# EAGLE design capsenbrd (EAGLE 7.6.0)

## Sheet 1 of 3
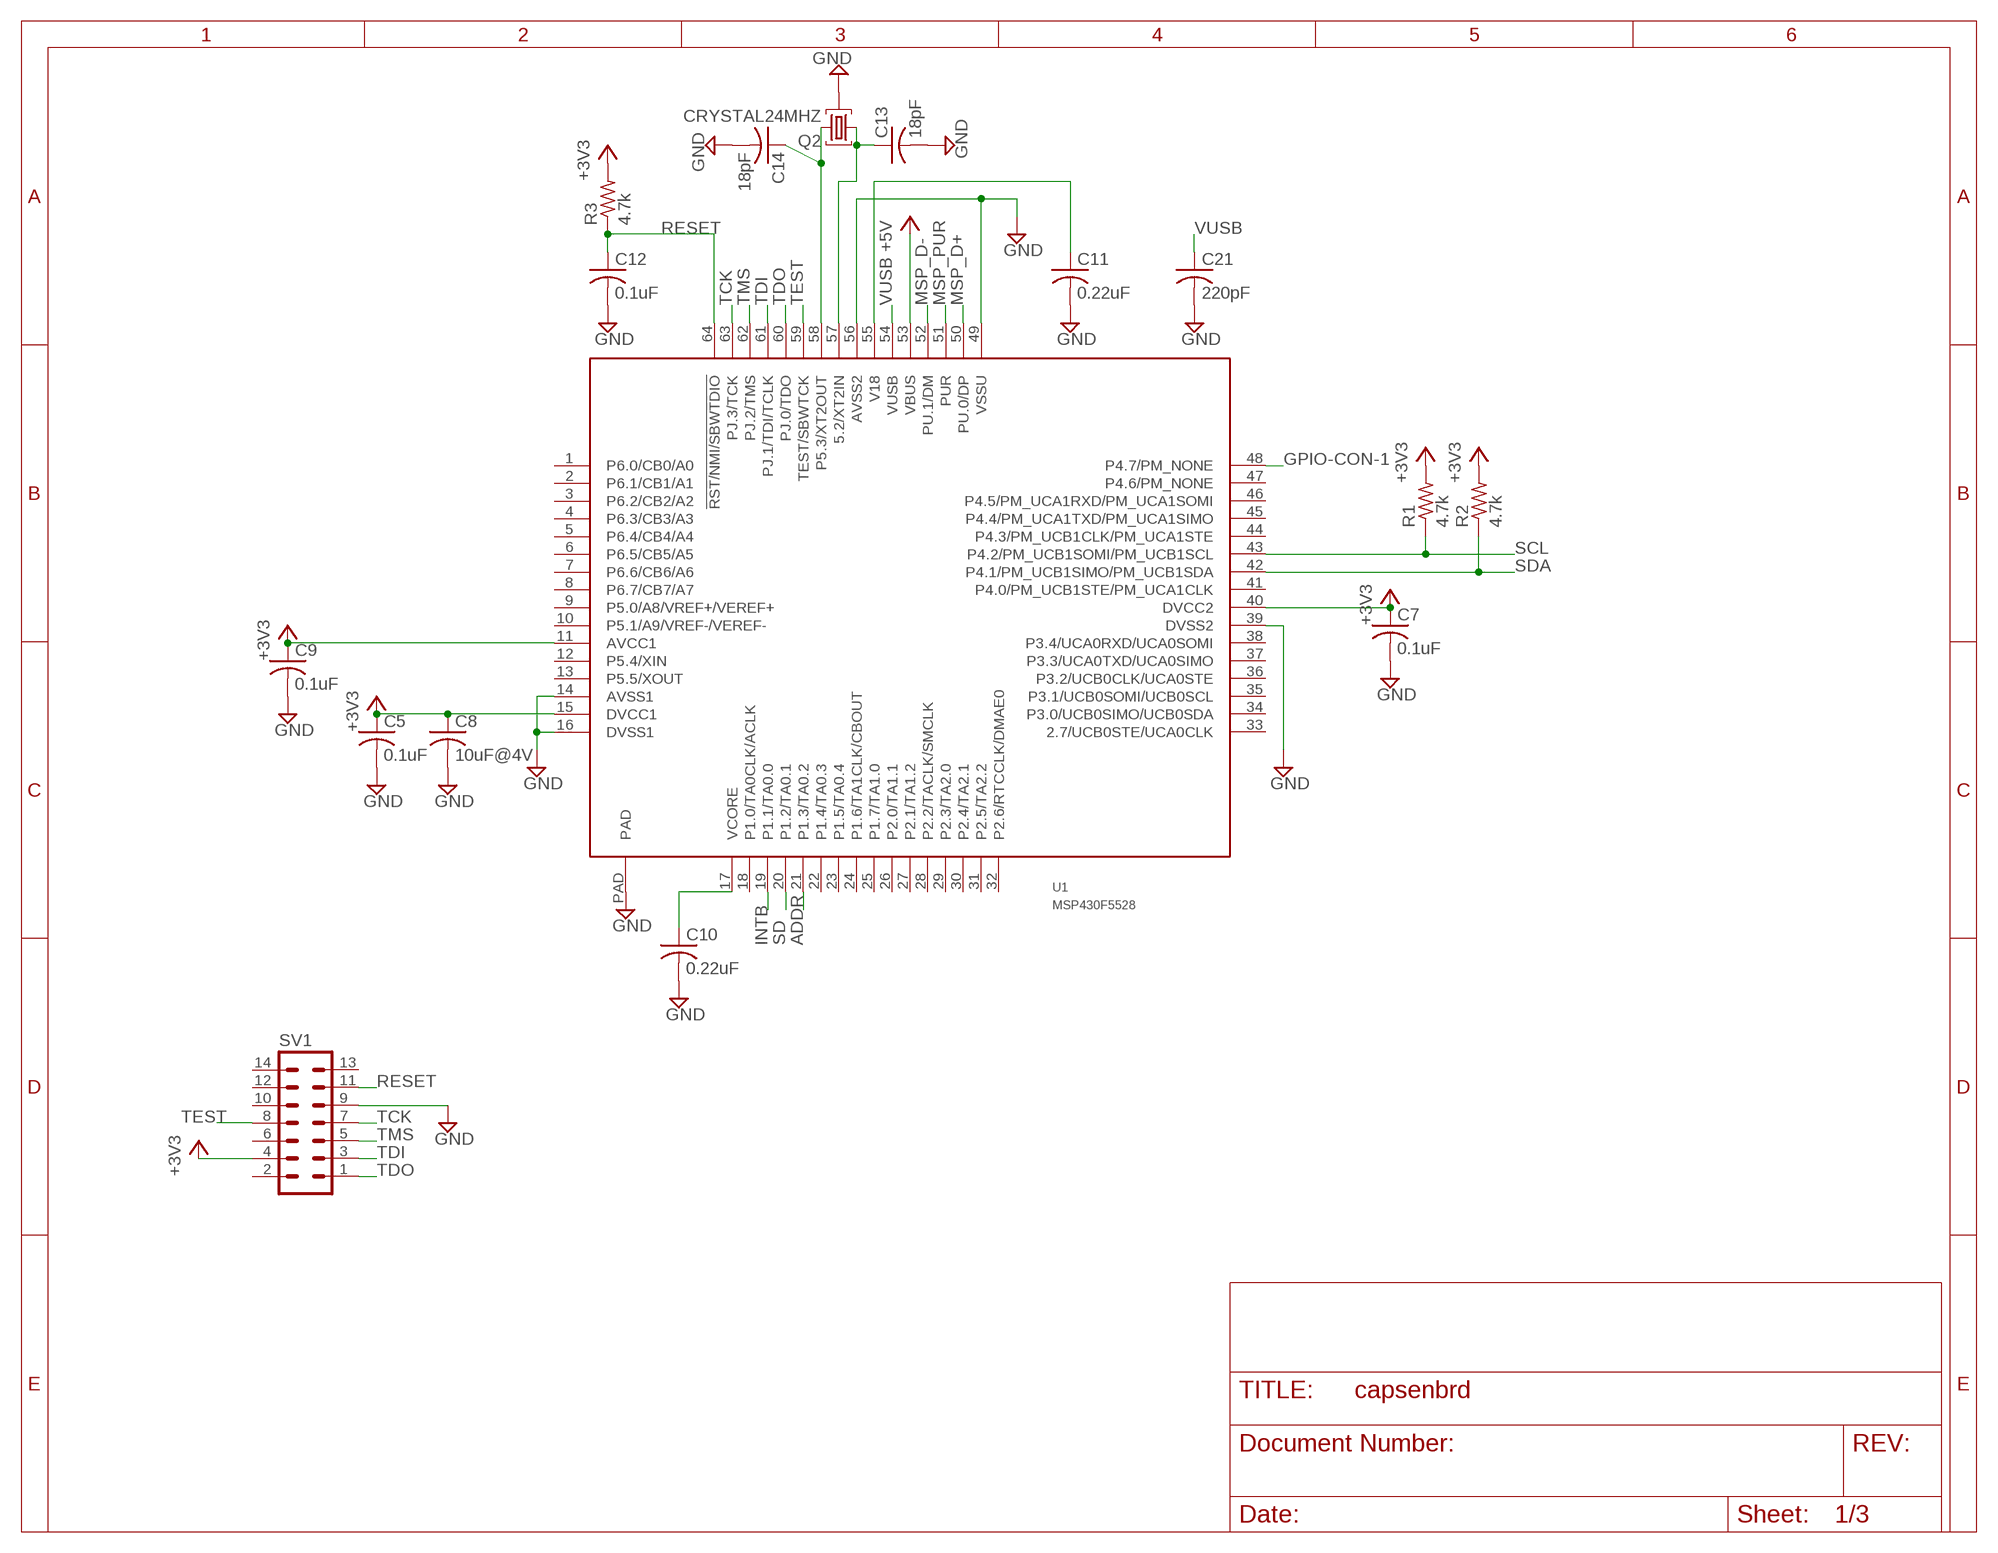
[diagram p0: schematic, sheet 1]

### Parts
C5  0.1uF  C-US0.1UFC0603  [C0603]
C7  0.1uF  C-US0.1UFC0603  [C0603]
C8  10uF@4V  C-US10UFC0603  [C0603]
C9  0.1uF  C-US0.1UFC0603  [C0603]
C10  0.22uF  C-US0.22UFC0603  [C0603]
C11  0.22uF  C-US0.22UFC0603  [C0603]
C12  0.1uF  C-US0.1UFC0603  [C0603]
C13  18pF  C-US18PFC0603  [C0603]
C14  18pF  C-US18PFC0603  [C0603]
C21  220pF  C-US-220PF-C0603  [C0603]
Q2  CRYSTAL24MHZ  [ABM8]
R1  4.7k  R-US_4.7KR0603  [R0603]
R2  4.7k  R-US_4.7KR0603  [R0603]
R3  4.7k  R-US_4.7KR0603  [R0603]
SV1  MA07-2SMT  [MA07-2-SMT]
U1  MSP430F5528  [-RGC-N64]

### Nets
+3V3: C5.1 C7.1 C8.1 C9.1 R1.2 R2.2 R3.2 SV1.4 U1.11(AVCC1) U1.15(DVCC1) U1.40(DVCC2) ; also sheet 2,3
+5V: U1.53(VBUS) ; also sheet 2,3
ADDR: U1.21(P1.3/TA0.2) ; also sheet 2
GND: C5.2 C7.2 C8.2 C9.2 C10.2 C11.2 C12.2 C13.2 C14.2 C21.2 Q2.2 Q2.4 SV1.9 U1.14(AVSS1) U1.16(DVSS1) U1.39(DVSS2) U1.49(VSSU) U1.56(AVSS2) U1.PAD ; also sheet 2,3
GPIO-CON-1: U1.48(P4.7/PM_NONE) ; also sheet 2
INTB: U1.19(P1.1/TA0.0) ; also sheet 2
MSP_D+: U1.50(PU.0/DP) ; also sheet 3
MSP_D-: U1.52(PU.1/DM) ; also sheet 3
MSP_PUR: U1.51(PUR) ; also sheet 3
N$2: C11.1 U1.55(V18)
N$3: C10.1 U1.17(VCORE)
N$5: C13.1 Q2.1 U1.57(5.2/XT2IN)
N$6: C14.1 Q2.3 U1.58(P5.3/XT2OUT)
RESET: C12.1 R3.1 SV1.11 U1.64(!RST/NMI/SBWTDIO)
SCL: R1.1 U1.43(P4.2/PM_UCB1SOMI/PM_UCB1SCL) ; also sheet 2
SD: U1.20(P1.2/TA0.1) ; also sheet 2
SDA: R2.1 U1.42(P4.1/PM_UCB1SIMO/PM_UCB1SDA) ; also sheet 2
TCK: SV1.7 U1.63(PJ.3/TCK)
TDI: SV1.3 U1.61(PJ.1/TDI/TCLK)
TDO: SV1.1 U1.60(PJ.0/TDO)
TEST: SV1.8 U1.59(TEST/SBWTCK)
TMS: SV1.5 U1.62(PJ.2/TMS)
VUSB: C21.1 U1.54(VUSB)
Unconnected: SV1.2 SV1.6 SV1.10 SV1.12 SV1.13 SV1.14 U1.1(P6.0/CB0/A0) U1.2(P6.1/CB1/A1) U1.3(P6.2/CB2/A2) U1.4(P6.3/CB3/A3) U1.5(P6.4/CB4/A4) U1.6(P6.5/CB5/A5) U1.7(P6.6/CB6/A6) U1.8(P6.7/CB7/A7) U1.9(P5.0/A8/VREF+/VEREF+) U1.10(P5.1/A9/VREF-/VEREF-) U1.12(P5.4/XIN) U1.13(P5.5/XOUT) U1.18(P1.0/TA0CLK/ACLK) U1.22(P1.4/TA0.3) U1.23(P1.5/TA0.4) U1.24(P1.6/TA1CLK/CBOUT) U1.25(P1.7/TA1.0) U1.26(P2.0/TA1.1) U1.27(P2.1/TA1.2) U1.28(P2.2/TACLK/SMCLK) U1.29(P2.3/TA2.0) U1.30(P2.4/TA2.1) U1.31(P2.5/TA2.2) U1.32(P2.6/RTCCLK/DMAE0) U1.33(2.7/UCB0STE/UCA0CLK) U1.34(P3.0/UCB0SIMO/UCB0SDA) U1.35(P3.1/UCB0SOMI/UCB0SCL) U1.36(P3.2/UCB0CLK/UCA0STE) U1.37(P3.3/UCA0TXD/UCA0SIMO) U1.38(P3.4/UCA0RXD/UCA0SOMI) U1.41(P4.0/PM_UCB1STE/PM_UCA1CLK) U1.44(P4.3/PM_UCB1CLK/PM_UCA1STE) U1.45(P4.4/PM_UCA1TXD/PM_UCA1SIMO) U1.46(P4.5/PM_UCA1RXD/PM_UCA1SOMI) U1.47(P4.6/PM_NONE)

## Sheet 2 of 3
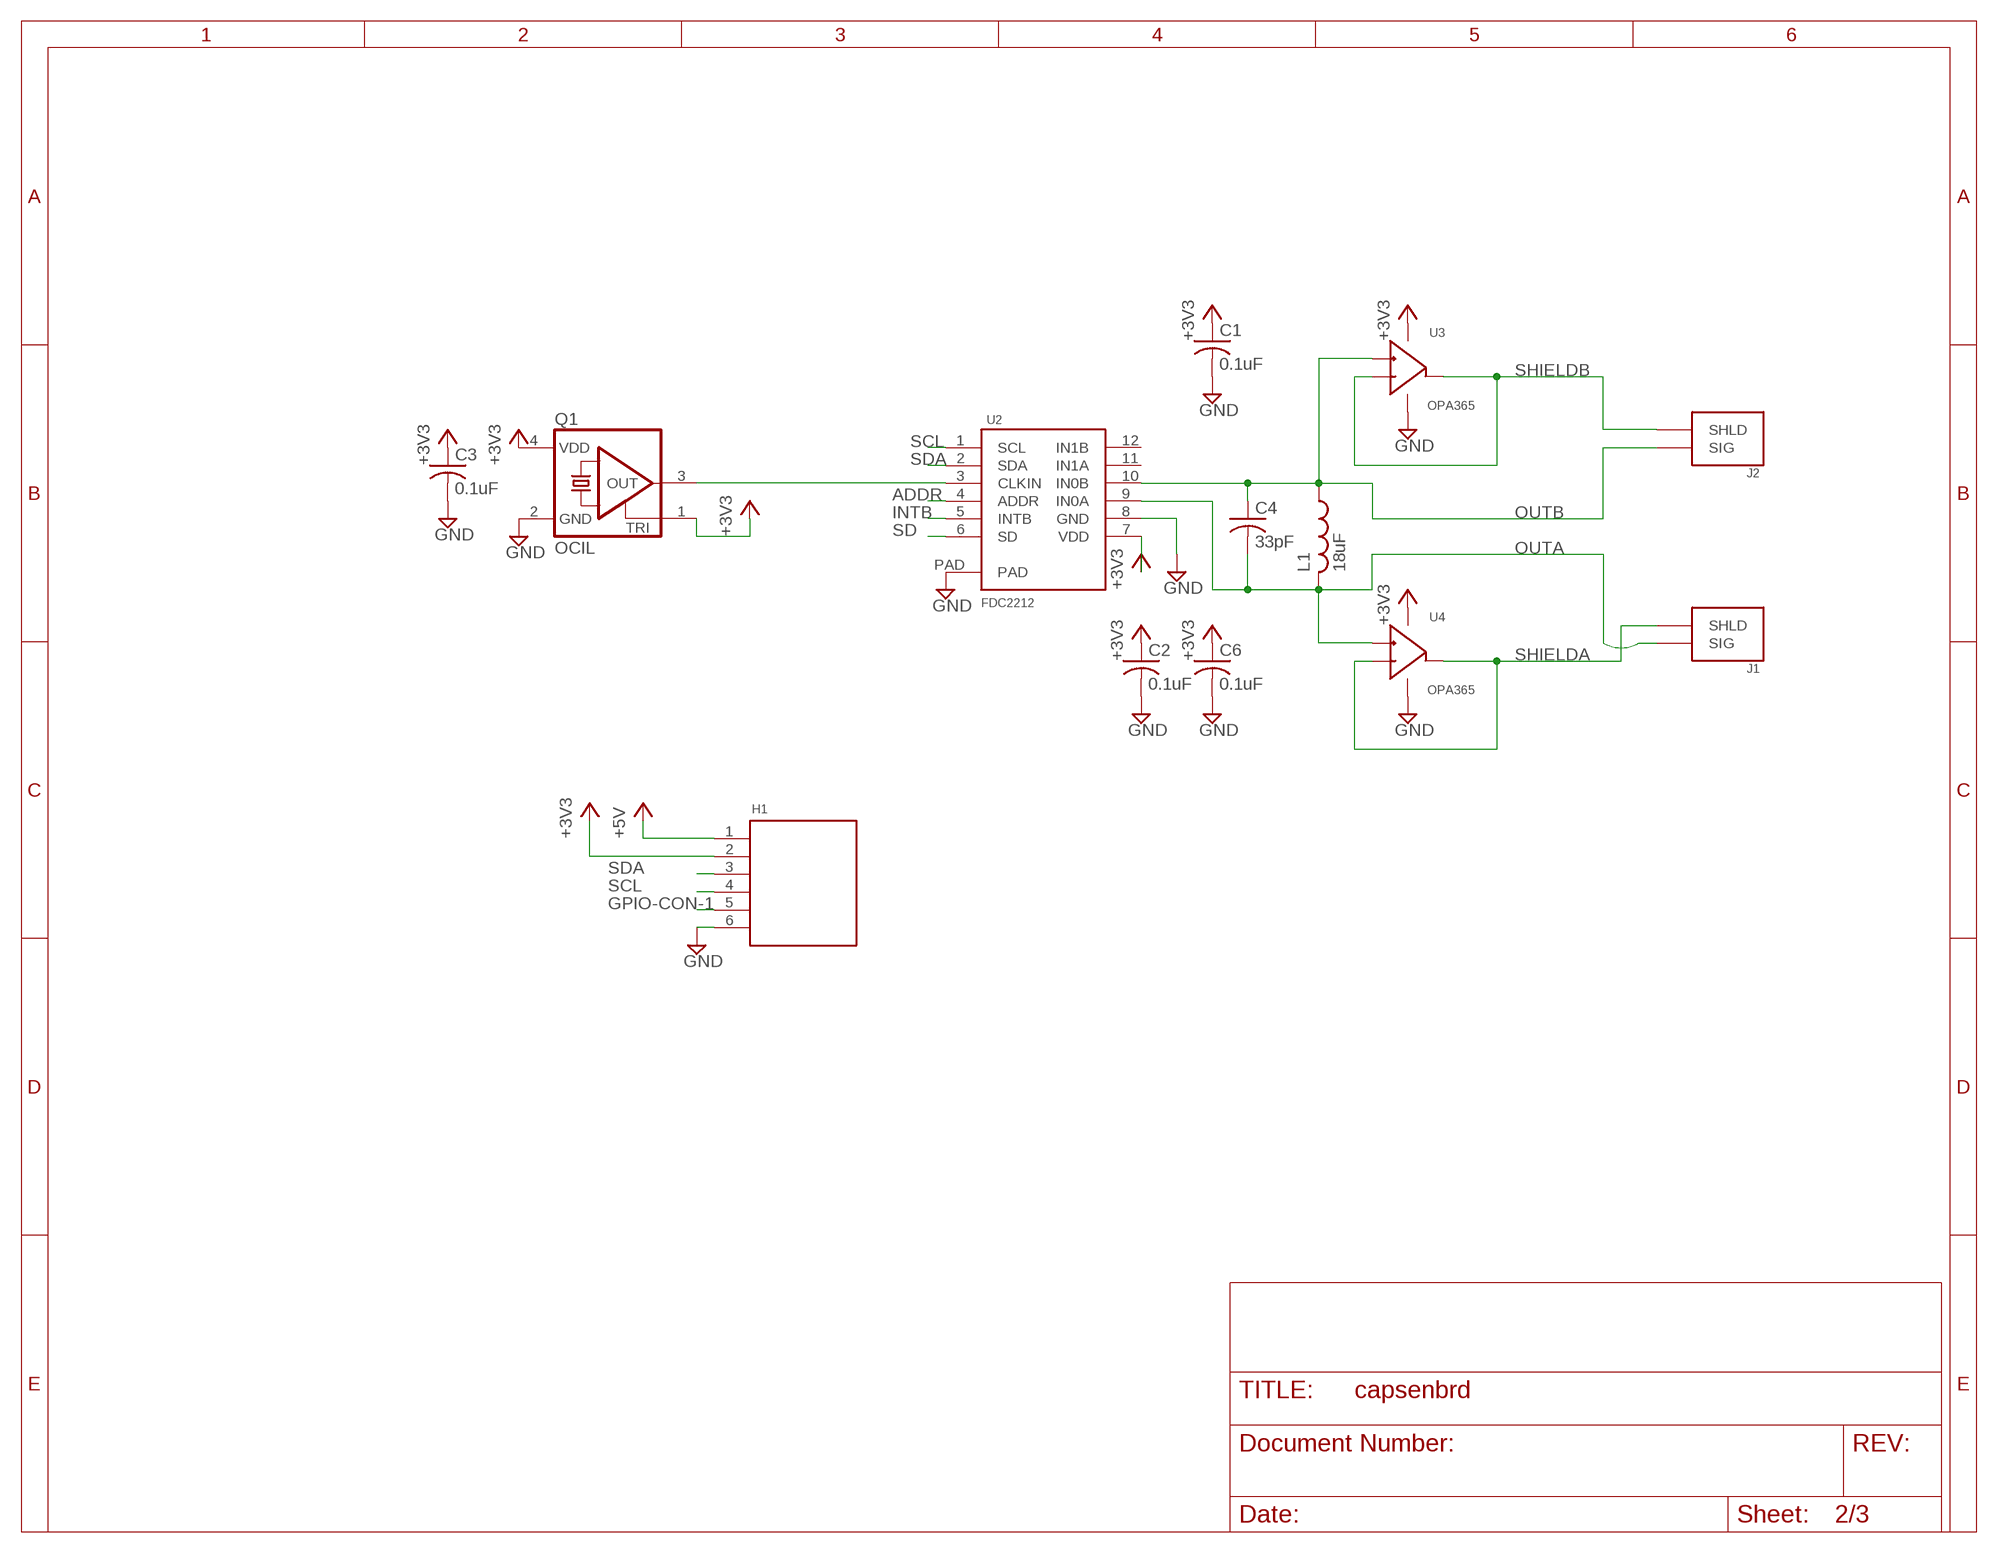
[diagram p1: schematic, sheet 2]

### Parts
C1  0.1uF  C-US0.1UFC0603  [C0603]
C2  0.1uF  C-US0.1UFC0603  [C0603]
C3  0.1uF  C-US0.1UFC0603  [C0603]
C4  33pF  C-US-33PF-C0603  [C0603]
C6  0.1uF  C-US0.1UFC0603  [C0603]
H1  CON-6-1  [10114828-10106LF]
J1  SMA-SMT-  [0732511352]
J2  SMA-SMT-  [0732511352]
L1  18uF  L-US-18UF-L1210  [L1210]
Q1  OCIL  [625L3C040M00000]
U2  FDC2212  [-WSON]
U3  OPA365  [-DBV]
U4  OPA365  [-DBV]

### Nets
+3V3: C1.1 C2.1 C3.1 C6.1 H1.2 Q1.1(TRI) Q1.4(VDD) U2.7(VDD) U3.5(V+) U4.5(V+) ; also sheet 1,3
+5V: H1.1 ; also sheet 1,3
ADDR: U2.4(ADDR) ; also sheet 1
GND: C1.2 C2.2 C3.2 C6.2 H1.6 Q1.2(GND) U2.8(GND) U2.PAD U3.2(V-) U4.2(V-) ; also sheet 1,3
GPIO-CON-1: H1.5 ; also sheet 1
INTB: U2.5(INTB) ; also sheet 1
N$1: Q1.3(OUT) U2.3(CLKIN)
OUTA: C4.2 J1.SIG L1.P$2 U2.9(IN0A) U4.3(IN+)
OUTB: C4.1 J2.SIG L1.P$1 U2.10(IN0B) U3.3(IN+)
SCL: H1.4 U2.1(SCL) ; also sheet 1
SD: U2.6(SD) ; also sheet 1
SDA: H1.3 U2.2(SDA) ; also sheet 1
SHIELDA: J1.SHLD1(SHLD) J1.SHLD2(SHLD) J1.SHLD3(SHLD) J1.SHLD4(SHLD) U4.1(VOUT) U4.4(IN-)
SHIELDB: J2.SHLD1(SHLD) J2.SHLD2(SHLD) J2.SHLD3(SHLD) J2.SHLD4(SHLD) U3.1(VOUT) U3.4(IN-)
Unconnected: U2.11(IN1A) U2.12(IN1B)

## Sheet 3 of 3
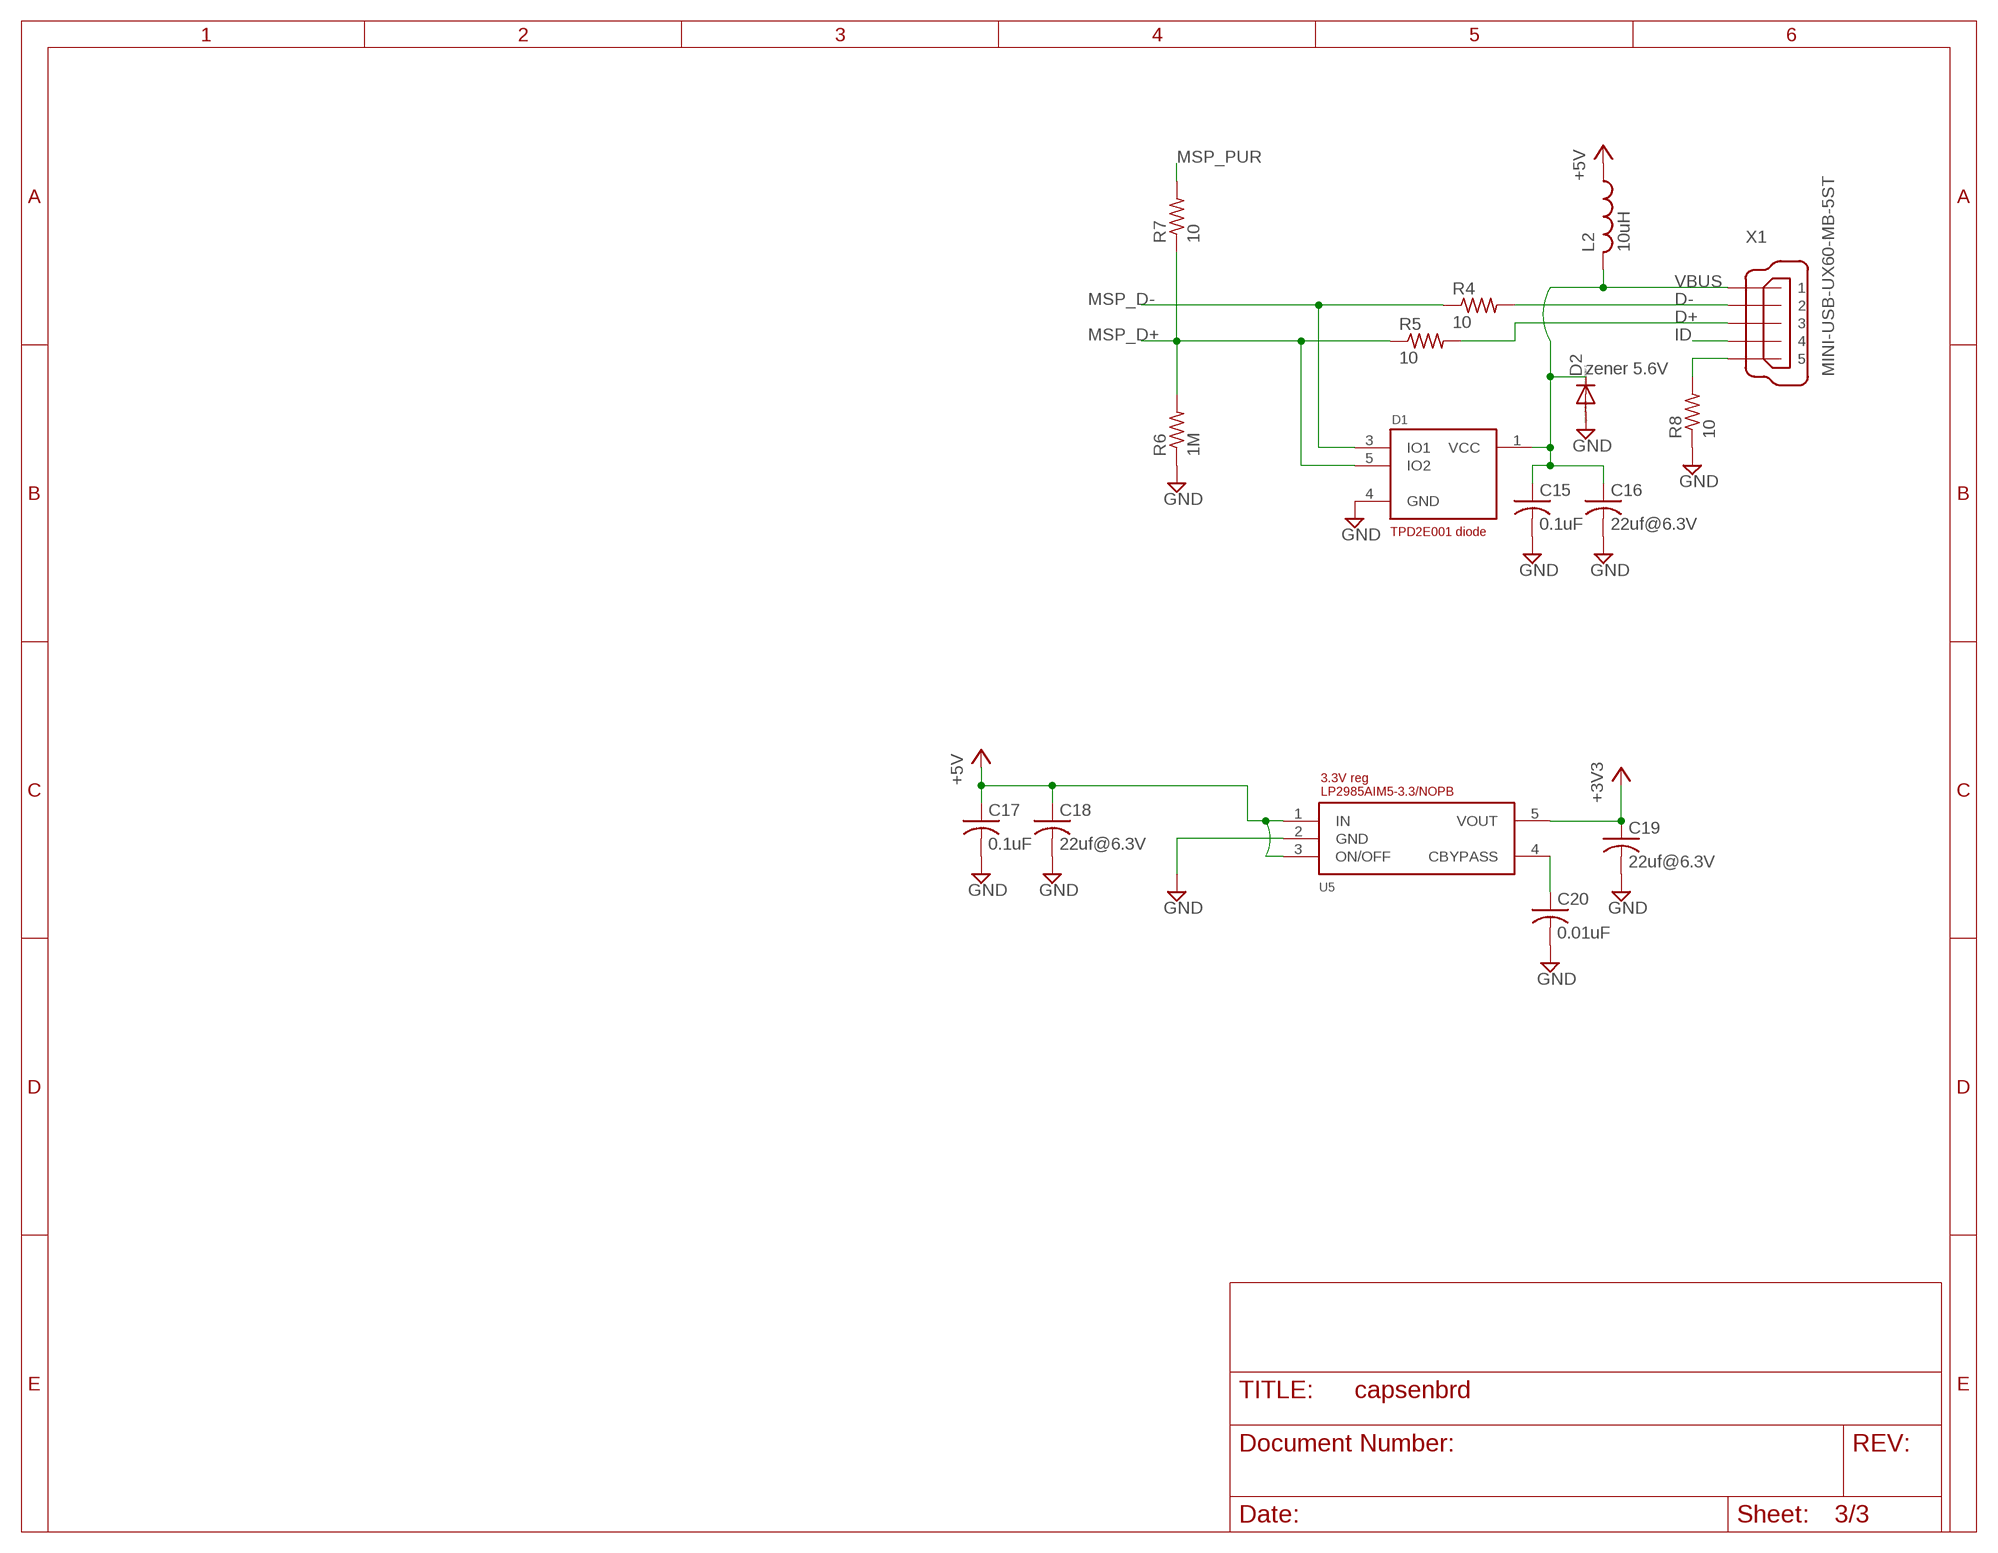
[diagram p2: schematic, sheet 3]

### Parts
C15  0.1uF  C-US0.1UFC0603  [C0603]
C16  22uf@6.3V  C-US22UFC0603  [C0603]
C17  0.1uF  C-US0.1UFC0603  [C0603]
C18  22uf@6.3V  C-US22UFC0603  [C0603]
C19  22uf@6.3V  C-US22UFC0603  [C0603]
C20  0.01uF  C-US-0.01UF-C0603  [C0603]
D1  USB-DIODE  [-DRL]
D2  zener 5.6V  DIODE-SOD123  [SOD123]
L2  10uH  L-US-10UH-VLS201610ET  [VLS201610ET]
R4  10  R-US_10R0603  [R0603]
R5  10  R-US_10R0603  [R0603]
R6  1M  R-US_1MR0603  [R0603]
R7  10  R-US_10R0603  [R0603]
R8  10  R-US_10R0603  [R0603]
U5  3.3V  VREG3.3V3.3V  [-DBV]
X1  MINI-USB-UX60-MB-5ST  [UX60-MB-5ST]

### Nets
+3V3: C19.1 U5.5(VOUT) ; also sheet 1,2
+5V: C17.1 C18.1 L2.P$1 U5.1(IN) U5.3(ON/OFF) ; also sheet 1,2
D+: R5.2 X1.3
D-: R4.2 X1.2
GND: C15.2 C16.2 C17.2 C18.2 C19.2 C20.2 D1.4(GND) D2.A R6.1 R8.1 U5.2(GND) ; also sheet 1,2
ID: X1.4
MSP_D+: D1.5(IO2) R5.1 R6.2 R7.1 ; also sheet 1
MSP_D-: D1.3(IO1) R4.1 ; also sheet 1
MSP_PUR: R7.2 ; also sheet 1
N$7: R8.2 X1.5
N$8: C20.1 U5.4(CBYPASS)
VBUS: C15.1 C16.1 D1.1(VCC) D2.C L2.P$2 X1.1

## Library data of the parts
C1-C3 C5-C7 C9 C12 C15 C17 = myLib:C-US: CAPACITOR, American symbol; MFG: yageo; MPN: CC0603KRX7R7BB104
C4 = myLib:C-US: CAPACITOR, American symbol; MFG: murata; MPN: GRM1885C1H330JA01D
C8 = myLib:C-US: CAPACITOR, American symbol; MFG: murata; MPN: GRM188R60G106ME47D
C10 C11 = myLib:C-US: CAPACITOR, American symbol; MFG: samsung; MPN: CL10B224KO8NNNC
C13 C14 = myLib:C-US: CAPACITOR, American symbol; MFG: panasonic; MPN: CL10C180JB8NNNC
C16 C18 C19 = myLib:C-US: CAPACITOR, American symbol; MFG: samsung; MPN: CL10A226MQ8NRNC
C20 = myLib:C-US: CAPACITOR, American symbol; MFG: murata; MPN: GRM1885C1H103JA01D
C21 = myLib:C-US: CAPACITOR, American symbol; MFG: murata; MPN: GRM1885C1H221JA01D
D1 = myLib:USB-DIODE; MFG: ti; MPN: TPD2E001DRLRG4
D2 = myLib:DIODE-: DIODE; MFG: diodes inc; MPN: MMSZ5232B-7-F
H1 = myLib:CON-6-1; MFG: FCI; MPN: 10114828-10106LF
J1 J2 = myLib:SMA; MFG: molex; MPN: 0732511352
L1 = myLib:L-US: INDUCTOR, American symbol; MFG: bourns; MPN: CMH322522-180KL
L2 = myLib:L-US: INDUCTOR, American symbol; MFG: tdk; MPN: VLS201610ET-100M
Q1 = myLib:OCIL: 3.3Vdc CMOS SMD CRYSTAL CLOCK OSCILLATOR SOurce: www.abracon.com; MFG: CTS; MPN: 625L3C040M00000
Q2 = myLib:CRYSTAL; MFG: Abracon; MPN: ABM8-24.000MHZ-B2-T
R1-R3 = myLib:R-US_: RESISTOR, American symbol; MFG: panasonic; MPN: ERJ-3GEYJ472V
R4 R5 R7 R8 = myLib:R-US_: RESISTOR, American symbol; MFG: panasonic; MPN: ERJ-3EKF10R0V
R6 = myLib:R-US_: RESISTOR, American symbol; MFG: panasonic; MPN: ERJ-3EKF1004V
SV1 = myLib:MA07-2: PIN HEADER
U1 = myLib:MSP430F5528; MFG: TI; MPN: MSP430F5528IRGCR
U2 = myLib:FDC2212; MFG: TI; MPN: FDC2212
U3 U4 = myLib:OPA365; MFG: TI; MPN: OPA365AIDBVR
U5 = myLib:VREG3.3V; MFG: TI; MPN: LP2985AIM5-3.3/NOPB
X1 = myLib:MINI-USB-: MINI USB Connector Source: http://www.hirose.co.jp/cataloge_hp/e24000019.pdf; MFG: Hirose; MPN: UX60-MB-5ST; OC_FARNELL: unknown; OC_NEWARK: unknown

## Board
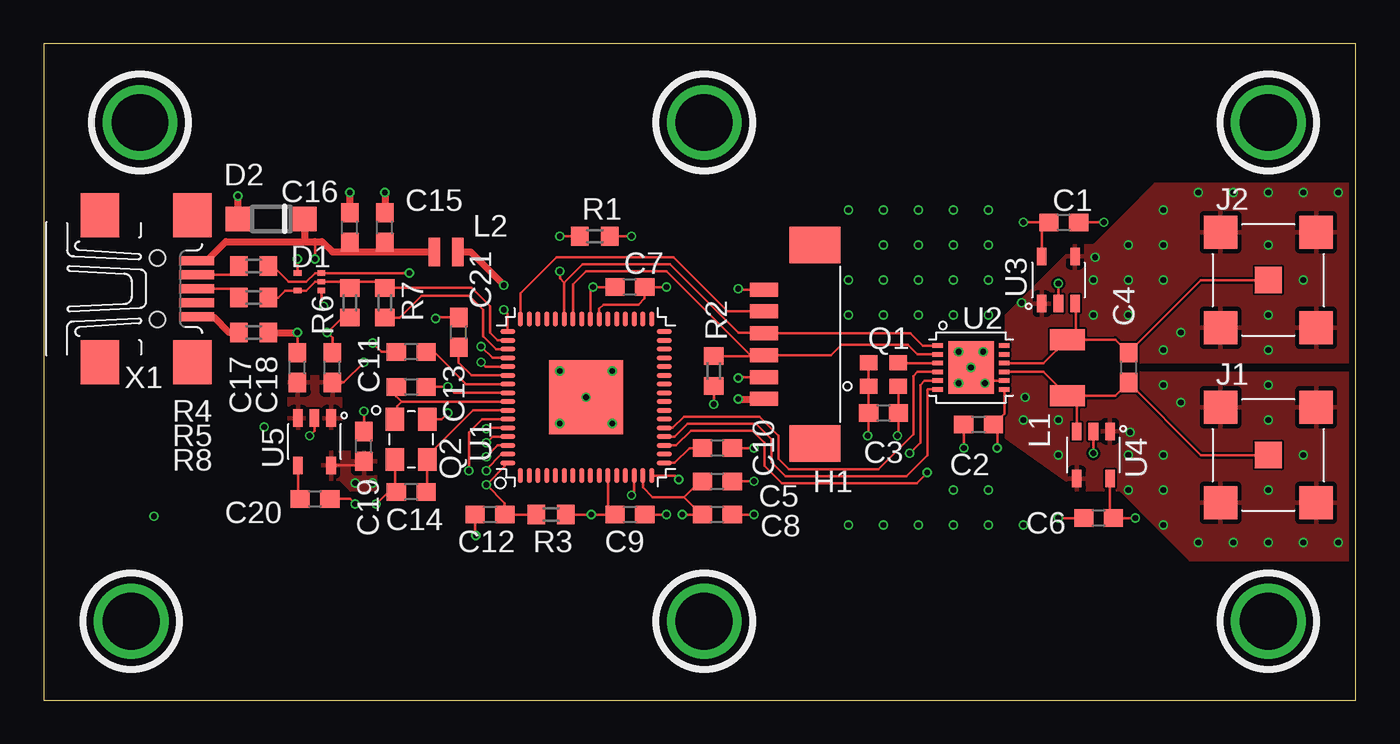
[diagram p3: board, top side]
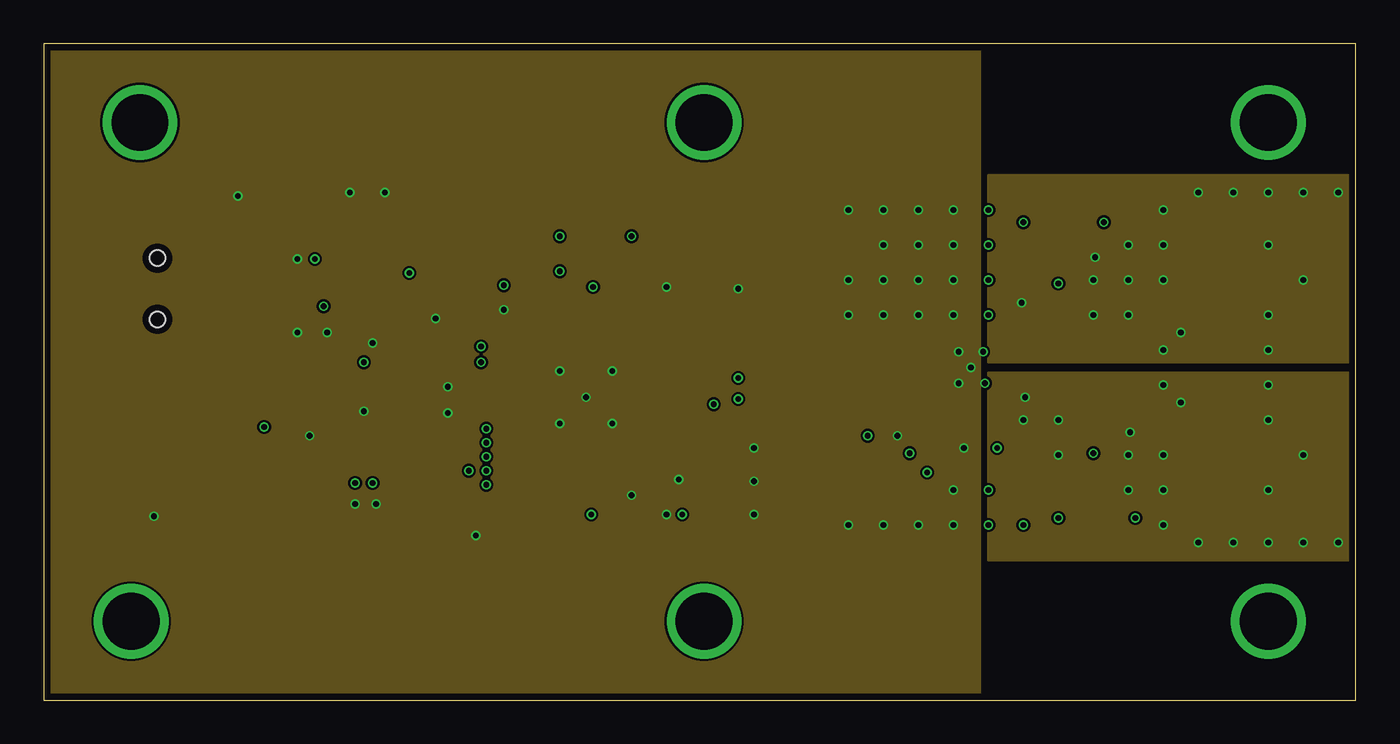
[diagram p4: board, inner layer Route2]
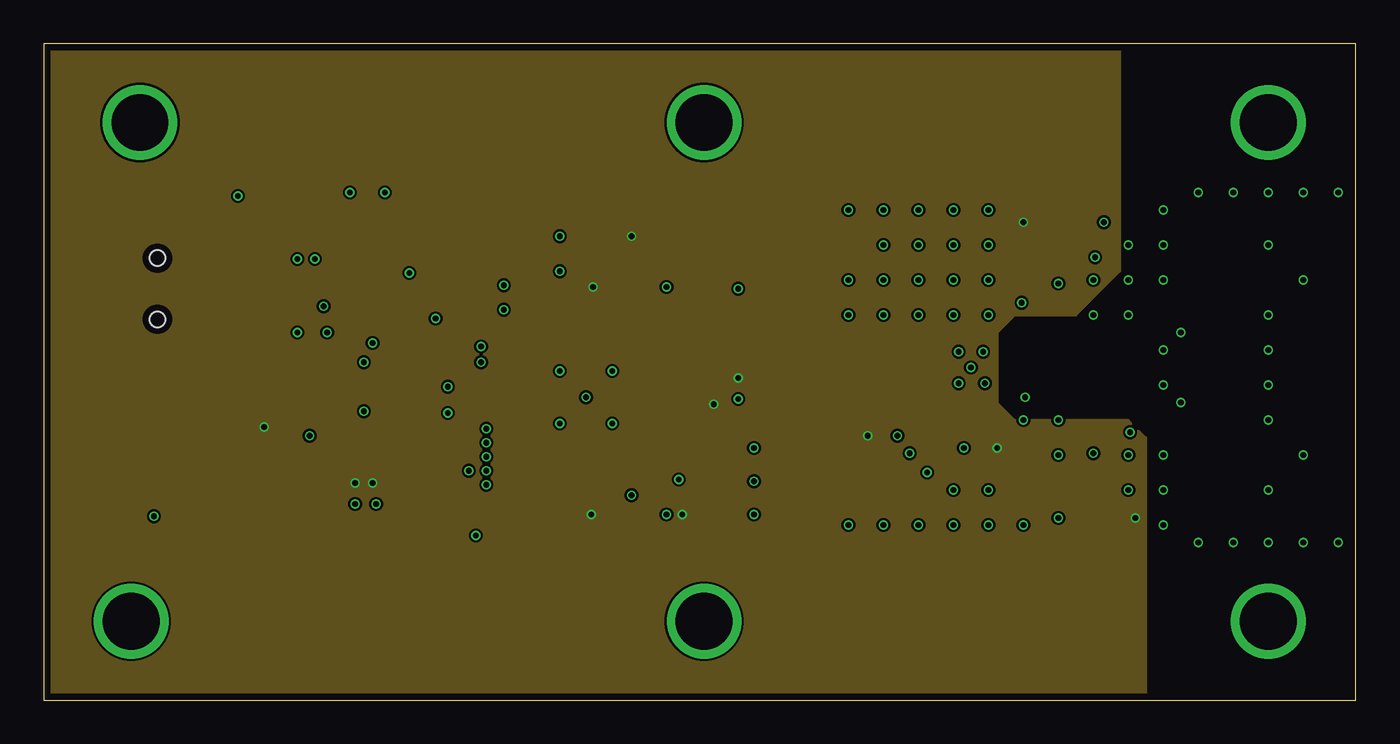
[diagram p5: board, inner layer Route15]
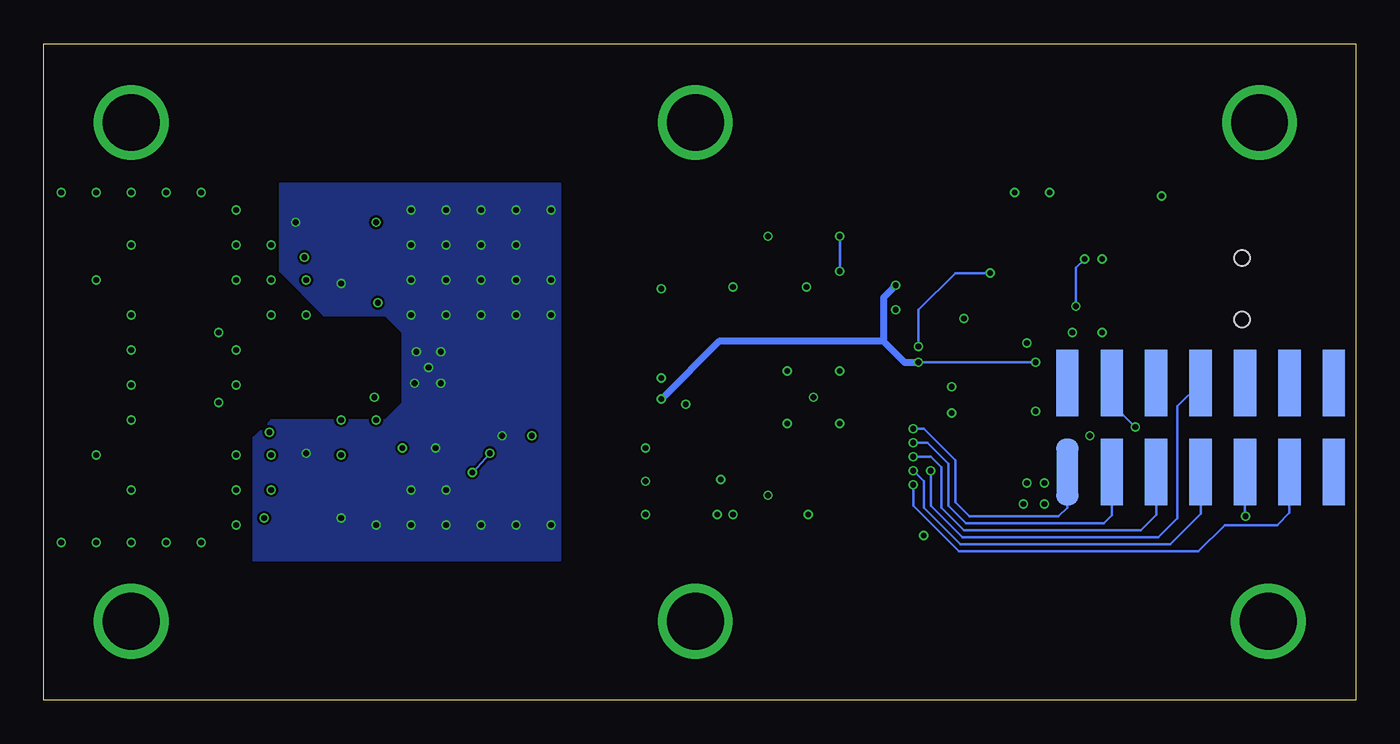
[diagram p6: board, bottom side, seen from below]

Size 75 x 37.5 mm. Coordinates in mm from the lower left corner, seen from the top.
Outline: 0,0 75,0 75,37.5 0,37.5 0,0
Copper layers (1*2*15*16): Top 0.035559375mm / dielectric 0.17018125mm / Route2 0.01778125mm / dielectric 47mil / Route15 0.01778125mm / dielectric 0.17018125mm / Bottom 0.035559375mm
Design rules "OSHPark-4layer *": minimum track width 5mil, minimum drill 10mil, track to track 5mil, track to pad 5mil, pad to pad 5mil, via to via 5mil, smd to smd 5mil, copper to edge 15mil, drill to drill 6mil, minimum pad ring 4mil, minimum via ring 4mil, stop-mask expansion 2.5mil, vias tented up to drill 14mil, thermal gap 10mil

### Footprints (pad centres in the part's own frame; a part is rotated, then mirrored left to right if it is on the bottom)
C0603 = smd 1.1 x 1: 1 -0.85,0; 2 0.85,0
-DRL = smd 0.3 x 0.45: 1 -0.5,-0.675; 2 0,-0.675; 3 0.5,-0.675; 4 0.5,0.675; 5 -0.5,0.675
SOD123 = smd 1.4 x 1.4: A 1.9,0; C -1.9,0
10114828-10106LF = smd 0.8 x 1.6: 1 -3.125,2.9; 2 -1.875,2.9; 3 -0.625,2.9; 4 0.625,2.9; 5 1.875,2.9; 6 3.125,2.9 | smd 2.1 x 2.9: NC1 -5.675,0; NC2 5.675,0
0732511352 = smd 1.91 x 1.91: SHLD1 -2.73,2.73; SHLD2 2.73,2.73; SHLD3 2.73,-2.73; SHLD4 -2.73,-2.73 | smd 1.52 x 1.52: SIG 0,0
L1210 = smd 1.2 x 2: P$1 -1.6,0; P$2 1.6,0
VLS201610ET = smd 0.65 x 1.6: P$1 -0.675,0; P$2 0.675,0
625L3C040M00000 = smd 1 x 0.85: 1 -0.85,-0.675; 2 0.85,-0.675; 3 0.85,0.675; 4 -0.85,0.675
ABM8 = smd 1.3 x 1.05: 1 -1.15,-0.925; 2 1.15,-0.925; 3 1.15,0.925; 4 -1.15,0.925
R0603 = smd 1 x 1.1: 1 -0.85,0; 2 0.85,0
MA07-2-SMT = smd 1.27 x 3.81: 1 -7.62,-2.54; 2 -7.62,2.54; 3 -5.08,-2.54; 4 -5.08,2.54; 5 -2.54,-2.54; 6 -2.54,2.54; 7 0,-2.54; 8 0,2.54; 9 2.54,-2.54; 10 2.54,2.54; 11 5.08,-2.54; 12 5.08,2.54; 13 7.62,-2.54; 14 7.62,2.54
-RGC-N64 = smd 0.85 x 0.28: 1 -4.475,3.75; 2 -4.475,3.25; 3 -4.475,2.75; 4 -4.475,2.25; 5 -4.475,1.75; 6 -4.475,1.25; 7 -4.475,0.75; 8 -4.475,0.25; 9 -4.475,-0.25; 10 -4.475,-0.75; 11 -4.475,-1.25; 12 -4.475,-1.75; 13 -4.475,-2.25; 14 -4.475,-2.75; 15 -4.475,-3.25; 16 -4.475,-3.75; 33 4.475,-3.75; 34 4.475,-3.25; 35 4.475,-2.75; 36 4.475,-2.25; 37 4.475,-1.75; 38 4.475,-1.25; 39 4.475,-0.75; 40 4.475,-0.25; 41 4.475,0.25; 42 4.475,0.75; 43 4.475,1.25; 44 4.475,1.75; 45 4.475,2.25; 46 4.475,2.75; 47 4.475,3.25; 48 4.475,3.75 | smd 0.28 x 0.85: 17 -3.75,-4.475; 18 -3.25,-4.475; 19 -2.75,-4.475; 20 -2.25,-4.475; 21 -1.75,-4.475; 22 -1.25,-4.475; 23 -0.75,-4.475; 24 -0.25,-4.475; 25 0.25,-4.475; 26 0.75,-4.475; 27 1.25,-4.475; 28 1.75,-4.475; 29 2.25,-4.475; 30 2.75,-4.475; 31 3.25,-4.475; 32 3.75,-4.475; 49 3.75,4.475; 50 3.25,4.475; 51 2.75,4.475; 52 2.25,4.475; 53 1.75,4.475; 54 1.25,4.475; 55 0.75,4.475; 56 0.25,4.475; 57 -0.25,4.475; 58 -0.75,4.475; 59 -1.25,4.475; 60 -1.75,4.475; 61 -2.25,4.475; 62 -2.75,4.475; 63 -3.25,4.475; 64 -3.75,4.475 | smd 4.25 x 4.25: PAD 0,0
-WSON = smd 0.25 x 0.6: 1 -1.25,-1.9; 2 -0.75,-1.9; 3 -0.25,-1.9; 4 0.25,-1.9; 5 0.75,-1.9; 6 1.25,-1.9; 7 1.25,1.9; 8 0.75,1.9; 9 0.25,1.9; 10 -0.25,1.9; 11 -0.75,1.9; 12 -1.25,1.9 | smd 3 x 2.6: PAD 0,0
-DBV = smd 0.55 x 1: 1 -0.95,-1.35; 2 0,-1.35; 3 0.95,-1.35; 4 0.95,1.35; 5 -0.95,1.35
UX60-MB-5ST = smd 2 x 0.5: 1 2.25,1.6; 2 2.25,0.8; 3 2.25,0; 4 2.25,-0.8; 5 2.25,-1.6 | smd 2.2 x 2.5: M1 -3.3,-4.2; M2 -3.3,4.2; M3 2,4.2; M4 2,-4.2 | hole 0.9: 0,-1.75; 0,1.75

### Placement (x,y rotation side)
C1  58.3,27.3 0 top
C2  53.44,15.74 180 top
C3  48,16.4 0 top
C4  62,19 270 top
C5  38.5,12.5 0 top
C6  60.3,10.4 180 top
C7  33.5,23.6 0 top
C8  38.5,10.6 0 top
C9  33.5,10.6 0 top
C10  38.5,14.4 0 top
C11  21,19.9 180 top
C12  25.5,10.6 180 top
C13  21,17.9 0 top
C14  21,11.9 180 top
C15  19.5,27 90 top
C16  17.5,27 90 top
C17  14.5,19 90 top
C18  16.5,19 90 top
C19  18.3,14.5 90 top
C20  15.5,11.5 0 top
C21  23.72,21.01 90 top
D1  15.2,23.9 90 top
D2  13,27.5 180 top
H1  44.08,20.33 90 top
J1  70,14 0 top
J2  70,24 0 top
L1  58.5,19 270 top
L2  23,25.6 180 top
Q1  48,18.6 0 top
Q2  21,14.9 270 top
R1  31.5,26.5 0 top
R2  38.3,18.8 270 top
R3  29,10.6 0 top
R4  12,24.8 180 top
R5  12,23 180 top
R6  17.5,22.7 90 top
R7  19.5,22.7 270 top
R8  12,21 180 top
SV1  8.87,15.57 0 bottom
U1  31,17.3 90 top
U2  53,19 270 top
U3  58,24 0 top
U4  60,14 180 top
U5  15.48,14.76 180 top
X1  6.5,23.5 0 top

### Tracks (layer width: path | path; a pad name or v marks a point on that pad's centre or on a via)
+3V3  (via drill 0.33)
  Top 0.152: U5.5 17.76,13.41 C19.1 | U4.5 60.95,10.53 C6.1 v62.4,10.4 | U3.5 57.05,26.99 C1.1 v56,27.3 | v54.5,14.4 54.5,15.73 C2.1 54.9,16.35 U2.7 | Q1.4 Q1.1 C3.1 47.15,15.15 v47.1,15.1 | U1.11 32.25,10.9 C9.1 v31.3,10.6 R3.2 29.9,10.45 | U1.15 34.25,12.15 34.8,11.6 36.6,11.6 | C5.1 37.5,12.5 36.6,11.6 | C8.1 37.6,10.6 | 37.6,10.6 36.6,11.6 | 37.6,10.6 v36.5,10.6 | U1.40 31.25,23.45 v31.4,23.6 C7.1 | v33.6,26.5 R1.2 | R2.2 v38.3,16.9 | H1.2 39.76,18.45 v39.7,18.4
  Bottom 0.152: SV1.4 13.95,16.95 v12.6,15.6
  other vias: 17.8,12.4 18.8,12.4
  pour Route15: 61.5,37.5 61.5,24.5 59,22 55.5,22 54.5,21 54.5,17 55.5,16 62,16 63,15 63,0 45.5,0 45.5,37.5
  pour Route15: 0,37.5 53.5,37.5 53.5,0 0,0
  pour Top: 17.5,12 19,12 19,14.2 15.9,14.2 15.9,12.6 16.9,12.6
+5V  (via drill 0.33)
  Top 0.152: U1.53 25.25,19.05 v25,19.3 | C18.1 17.15,18.15 v18.3,19.3
  Top 0.406: L2.P$1 24.4,25.6 v26.3,23.7 | v39.7,17.2 H1.1
  Bottom 0.152: v18.3,19.3 v25,19.3
  Bottom 0.406: v25,19.3 25.8,19.3 27,20.5 | v26.3,23.7 27,23 27,20.5 | 27,20.5 36.4,20.5 v39.7,17.2
  pour Top: 14,18.5 17,18.5 17,15.5 16,15.5 16,16.7 14.9,16.7 14.9,15.5 14,15.5
AAA  (via drill 3.25)
  other vias: 70,33
ADDR
  Top 0.152: U2.4 49.95,18.75 49.7,18.5 49.7,15.2 47.7,13.2 42.6,13.2 42,13.8 42,15.1 40.9,16.2 36.6,16.2 35.95,15.55 U1.21
D+
  Top 0.152: X1.3 10.65,23.5 R5.2
D-
  Top 0.152: X1.2 10.65,24.3 R4.2
GND  (via drill 0.33)
  Top 0.152: C6.2 v58,10.4 | U3.2 v58,23.8 | C1.2 v60.6,27.3 | Q1.2 C3.2 48.85,15.15 v48.8,15.1 | U2.8 53.75,18.25 U2.PAD | C15.2 19.5,28 | C9.2 v35.6,10.6 | U1.16 36.08,12.82 v36.3,12.6 | C8.2 v40.6,10.6 | C5.2 v40.6,12.5 | C10.2 v40.6,14.4 | U1.14 33.75,11.85 v33.6,11.7 | C12.2 24.65,9.45 v24.7,9.4 | Q2.2 20.07,11.97 C14.2 19.7,11.9 v19,11.2 | C13.2 v23.1,17.9 23.45,17.55 U1.56 | Q2.4 22.75,16.05 v23.1,16.4 | C19.2 v18.3,16.5 | C17.2 v14.5,21 | C18.2 16.5,20.7 v16.2,21 17.05,21.85 R6.1 | C11.2 19.3,19.9 v18.8,20.4 | D1.4 14.53,25.18 v14.5,25.2 | C20.2 17.5,11.5 v17.8,11.2 | v35.6,23.6 C7.2 34.35,22.95 34,22.6 32,22.6 31.75,22.35 U1.39 | U1.49 26.52,22.07 v26.3,22.3 | C21.2 22.46,21.86 v22.4,21.8 | U4.2 v60,14.1 | U5.2 15.48,15.38 v15.2,15.1 | H1.6 39.74,23.45 v39.7,23.5 | C2.2 v52.59,14.41 v52.6,14.4
  Top 0.406: D2.A v11.1,28.8 | C16.2 v17.5,29 | v19.5,29 19.5,28 | R8.1 v14.5,21
  Bottom 0.152: v58,10.4 58,10.5 | SV1.9 6.33,10.53 v6.3,10.5
  other vias: 53,19 53.7,19.9 52.3,19.9 52.3,18.1 53.8,18.1 31,17.3 32.5,18.8 29.5,15.8 32.5,15.8 29.5,18.8 54,10 52,10 50,10 48,10 46,10 56,10 54,12 52,12 46,22 48,22 50,22 52,22 54,22 54,24 52,24 50,24 48,24 46,24 48,26 48,28 46,28 50,28 52,28 54,28 54,26 52,26 50,26
  pour Bottom: 61.5,29.5 61.5,24.5 59,22 55.5,22 54.5,21 54.5,17 55.5,16 62,16 63,15 63,8 45.5,8 45.5,29.5
  pour Route2: 0,37.5 53.5,37.5 53.5,0 0,0
GPIO-CON-1
  Top 0.152: H1.5 39.09,22.2 36,25.3 29.3,25.3 27.25,23.25 U1.48
INTB  (via drill 0.33)
  Top 0.152: U2.5 50.35,18.25 50.1,18 50.1,14.7 v49.5,14.1 | U1.19 36.15,14.55 37,15.4 40.5,15.4 41.2,14.7 41.2,13.4 42.2,12.4 49.9,12.4 v50.5,13
  Bottom 0.152: v50.5,13 v49.5,14.1
MSP_D+
  Top 0.152: U1.50 25.95,20.55 25.5,21 25.5,22.5 24.45,23.55 R7.1 19.15,23.9 17.5,23.9 | R5.1 13.4,23 13.8,23.4 D1.5 15,23.4 15.5,23.9 17.5,23.9 | R6.2 17.5,23.9
MSP_D-  (via drill 0.33)
  Top 0.152: v20.9,24.4 D1.3 15.5,24.4 15,23.9 14,23.9 13.1,24.8 R4.1 | U1.52 25.65,19.55 v25,20.2
  Bottom 0.152: v25,20.2 25,22.3 22.9,24.4 v20.9,24.4
MSP_PUR
  Top 0.152: U1.51 25.85,20.05 25.1,20.8 25.1,22.3 24.3,23.1 21.6,23.1 20.35,21.85 R7.2
N$1
  Top 0.152: U2.3 49.01,19.25 Q1.3
N$2
  Top 0.152: U1.55 24.15,18.05 22.3,19.9 C11.1
N$3
  Top 0.152: U1.17 36.05,13.55 36.9,14.4 C10.1
N$4  (via drill 3.25)
  other vias: 5,4.5
N$5
  Top 0.152: U1.57 20.45,17.05 | 20.45,17.05 20.2,16.8 20.2,16.27 Q2.1 | C13.1 20.15,17.35 20.45,17.05
N$6
  Top 0.152: C14.1 21.93,11.97 Q2.3 21.93,13.93 24.55,16.55 U1.58
N$7
  Top 0.406: R8.2 10.6,21 9.7,21.9 X1.5
N$8
  Top 0.152: U5.4 14.53,11.62 C20.1
N$9  (via drill 3.25)
  other vias: 37.75,33
N$10  (via drill 3.25)
  other vias: 5.5,33
N$11  (via drill 3.25)
  other vias: 37.75,4.5
N$12  (via drill 3.25)
  other vias: 70,4.5
OUTA
  Top 0.152: U4.3 59.05,16.85 L1.P$2 | L1.P$2 61.25,17.4 C4.2 66.15,14 J1.SIG | U2.9 57.15,18.75 L1.P$2
OUTB
  Top 0.152: 59,20.6 L1.P$1 57.15,19.25 U2.10 | 59,20.6 61.25,20.6 C4.1 66.15,24 J2.SIG | U3.3 59,22.6 59,20.6
RESET  (via drill 0.33)
  Top 0.152: U1.64 26.35,13.55 26.35,13.35 v25.3,12.3 26.35,11.25 C12.1 R3.1
  Bottom 0.152: v25.3,12.3 25.3,11.1 22.7,8.5 9,8.5 7.5,10 4.5,10 3.79,10.71 SV1.11
SCL  (via drill 0.33)
  Top 0.152: U1.43 29.75,23.85 | 29.75,23.85 30.8,24.9 35.8,24.9 39.7,21 41.63,21 H1.4 49.55,20.95 50.25,20.25 U2.1 | R1.1 v29.5,26.5 | v29.5,24.5 29.5,24.1 29.75,23.85
  Bottom 0.152: v29.5,26.5 v29.5,24.5
SD
  Top 0.152: U2.6 50.55,17.75 50.5,17.7 50.5,14 49.3,12.8 42.4,12.8 41.6,13.6 41.6,14.9 40.7,15.8 36.8,15.8 36.05,15.05 U1.20
SDA
  Top 0.152: U1.42 30.25,23.75 31,24.5 35.6,24.5 40.4,19.7 H1.3 | H1.3 45,19.7 45.59,20.3 49.4,20.3 49.95,19.75 U2.2 | R2.1 41.12,19.65 H1.3
SHIELDA  (via drill 0.33)
  other vias: 62.1,15.3 56.1,17.3 56,16 58,16 58,14 62,14 62,12 64,12 64,10 64,14 66,9 68,9 70,9 72,9 74,9 64,18 65,17 70,16 70,12 72,14 70,18
  pour Top: 55,18.7 55,15 58.5,12.5 58.5,12 61.5,12 65.5,8 75.5,8 75.5,18.7
  pour Route2: 54,18.7 54,8 75,8 75,18.7
SHIELDB  (via drill 0.33)
  other vias: 60.1,25.3 55.9,22.7 60,24 60,22 62,22 62,24 62,26 64,26 64,28 64,24 66,29 68,29 70,29 72,29 74,29 70,26 72,24 70,22 64,20 65,21 70,20
  pour Route2: 54,30 54,19.3 75,19.3 75,30
  pour Top: 58.5,26 58.5,25.5 55,22 55,19.3 75.5,19.3 75.5,29.5 63.5,29.5 60,26
TCK  (via drill 0.33)
  Top 0.152: v25.3,13.1 25.3,13.2 26.15,14.05 U1.63
  Bottom 0.152: SV1.7 8.87,10.63 10.6,8.9 22.6,8.9 24.7,11 24.7,12.5 v25.3,13.1
TDI  (via drill 0.33)
  Top 0.152: U1.61 25.65,15.05 v25.3,14.7
  Bottom 0.152: SV1.3 13.95,10.55 14.4,10.1 22.3,10.1 23.3,11.1 23.3,13.5 24.5,14.7 v25.3,14.7
TDO  (via drill 0.33)
  Top 0.152: U1.60 25.35,15.55 v25.3,15.5
  Bottom 0.152: SV1.1 16.5,11 17,10.5 22.1,10.5 22.9,11.3 22.9,13.7 24.7,15.5 v25.3,15.5
TEST  (via drill 0.33)
  Top 0.152: U1.59 25.05,16.05 24.3,15.3 v24.3,13.1
  Bottom 0.152: SV1.8 10.2,16.78 10.2,10.4 11.3,9.3 22.5,9.3 24.3,11.1 v24.3,13.1
TMS  (via drill 0.33)
  Top 0.152: U1.62 25.95,14.55 v25.3,13.9
  Bottom 0.152: SV1.5 11.41,10.59 12.3,9.7 22.4,9.7 23.7,11 23.7,13.3 24.3,13.9 v25.3,13.9
VBUS  (via drill 0.33)
  Top 0.152: D1.1 15.88,22.62 v16,22.5 | 16.2,25.9 16.5,25.6 | v15.5,25.2 15.5,26.2 | C16.1 17.5,25.5 18.85,25.5 C15.1
  Top 0.406: X1.1 9.3,25.1 10.4,26.2 15,26.2 | 15,26.2 15.5,26.2 15.9,26.2 16.5,25.6 17.5,25.6 | C16.1 17.5,25.6 | 17.5,25.6 L2.P$2 | D2.C 14.9,26.3 15,26.2
  Bottom 0.152: v16,22.5 16,24.7 v15.5,25.2
VUSB
  Top 0.152: U1.54 24.45,18.55 23.72,19.28 C21.1

### Text on the board
Document: C4 33pf 402 part needs 603 / check zener